# EAGLE design driver_inverter_potentio (EAGLE 9.0.1)
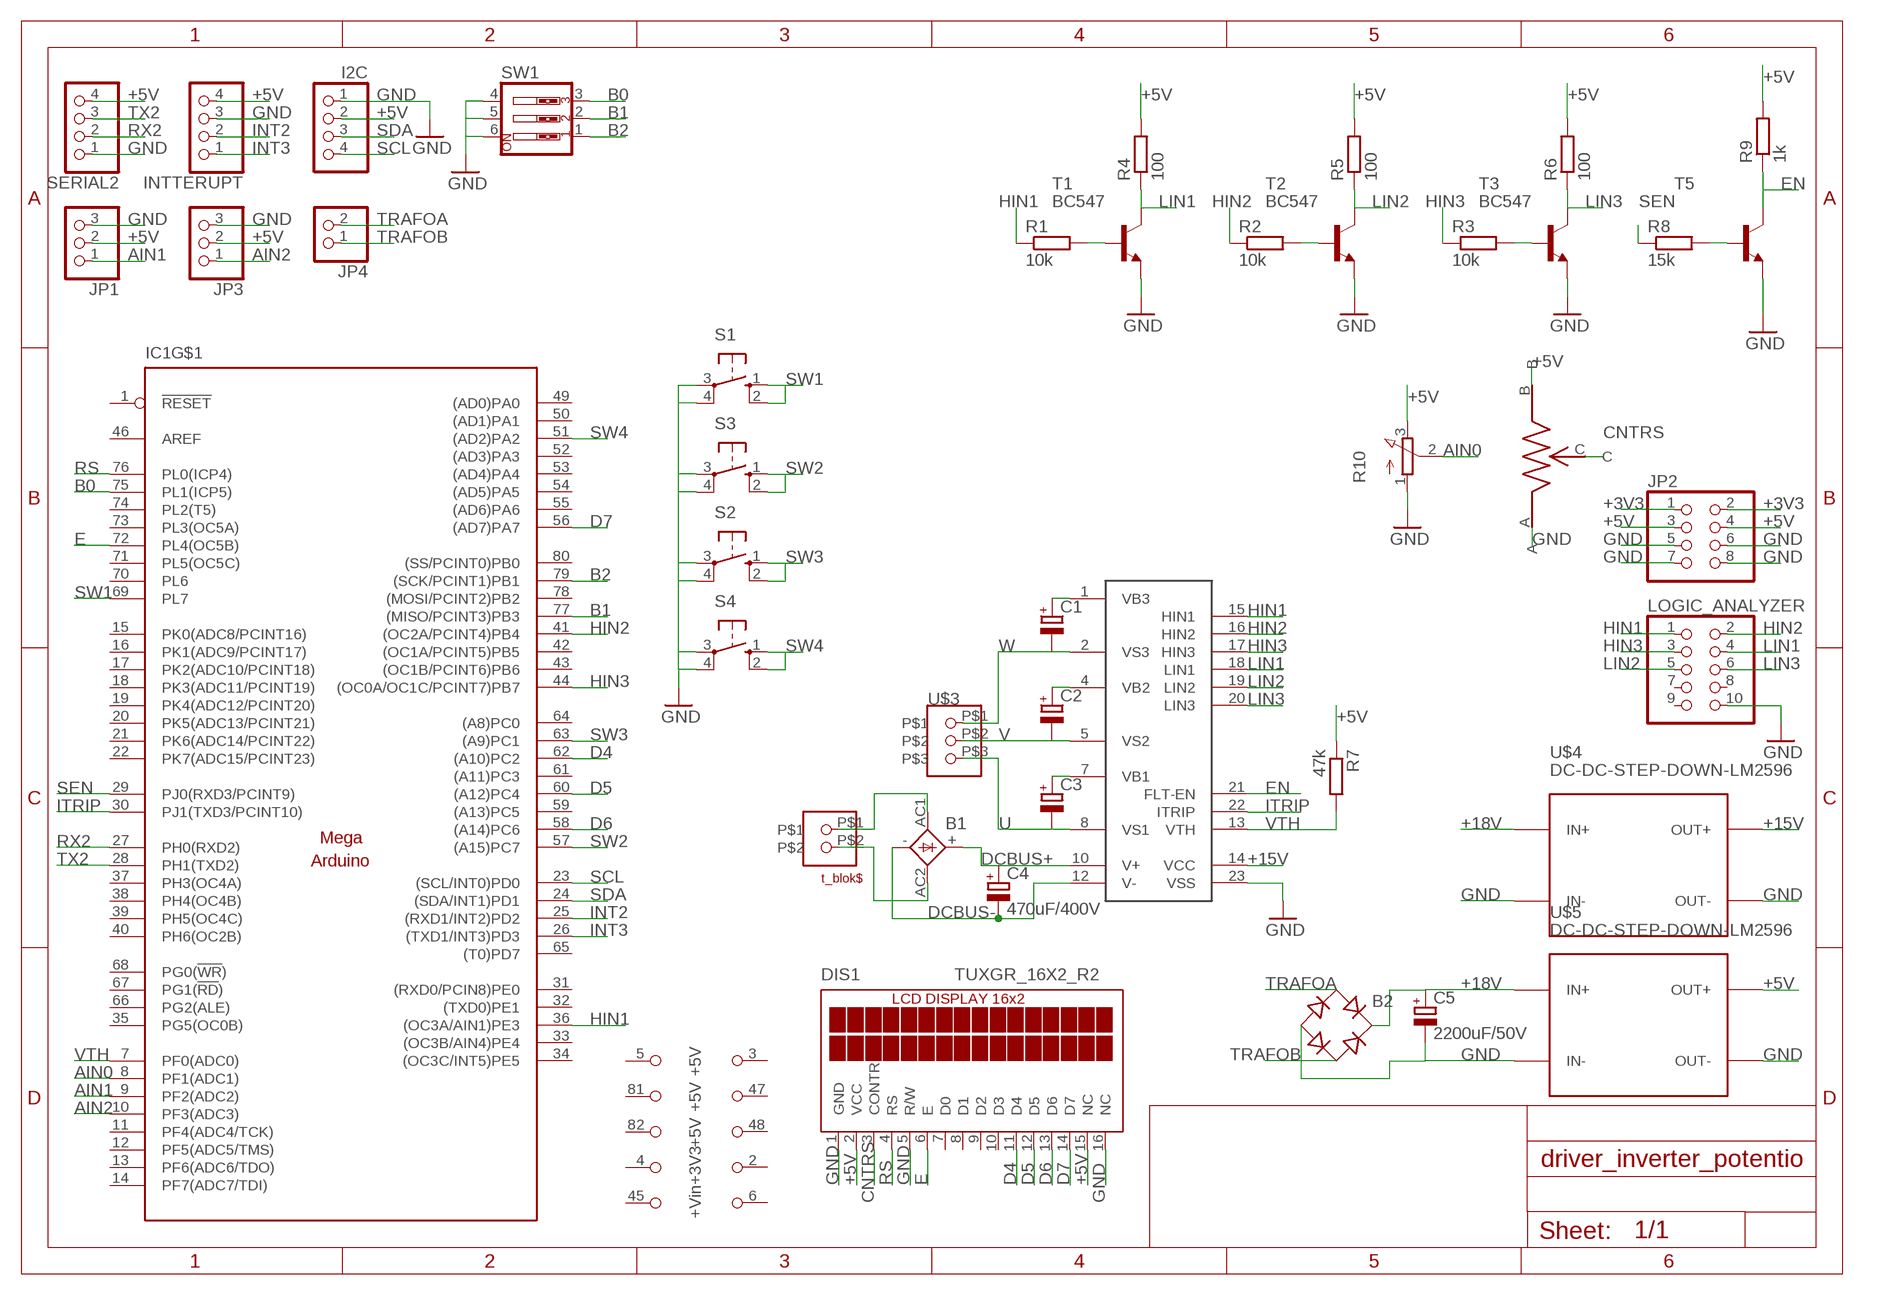
[diagram p0: schematic, sheet 1]

## Parts
B1  GBPC80X  [GBPC80X]
B2  RB1A  [RB1A]
C1  CPOL-EUE2.5-6  [E2,5-6]
C2  CPOL-EUE2.5-6  [E2,5-6]
C3  CPOL-EUE2.5-6  [E2,5-6]
C4  470uF/400V  CPOL-EUE10-25  [EB25D]
C5  2200uF/50V  CPOL-EUE7.5-16  [E7,5-16]
DIS1  TUXGR_16X2_R2  [TUXGR_16X2_R2]
I2C  PINHD-1X4  [1X04]
IC1  MEGAARDUINO_22  [MEGA_ARDUINO_2]
INTTERUPT  PINHD-1X4  [1X04]
JP1  PINHD-1X3  [1X03]
JP2  PINHD-2X4  [2X04]
JP3  PINHD-1X3  [1X03]
JP4  PINHD-1X2  [1X02]
LOGIC_ANALYZER  PINHD-2X5  [2X05]
R1  10k  R-EU_0207/10  [0207/10]
R2  10k  R-EU_0207/10  [0207/10]
R3  10k  R-EU_0207/10  [0207/10]
R4  100  R-EU_0207/10  [0207/10]
R5  100  R-EU_0207/10  [0207/10]
R6  100  R-EU_0207/10  [0207/10]
R7  47k  R-EU_0207/10  [0207/10]
R8  15k  R-EU_0207/10  [0207/10]
R9  1k  R-EU_0207/10  [0207/10]
R10  3RP/1610N  [3RP/1610N]
S1  10-XX  [B3F-10XX]
S2  10-XX  [B3F-10XX]
S3  10-XX  [B3F-10XX]
S4  10-XX  [B3F-10XX]
SERIAL2  PINHD-1X4  [1X04]
SW1  SW_DIP-3  [EDG-03]
T1  BC547  [TO92]
T2  BC547  [TO92]
T3  BC547  [TO92]
T5  BC317-NPN-TO92-EBC  [TO92-EBC]
U$1  IRAMS  [IRAMS]
U$2  TBLOCK_1X2  [TBLOCK_1X2]
U$3  TBLOCK_3PIN  [TBLOCK_1X3]
U$4  DC-DC-STEP-DOWN-LM2596  [DC-DC-STEP-DOWN-LM2596]
U$5  DC-DC-STEP-DOWN-LM2596  [DC-DC-STEP-DOWN-LM2596]
U$6  POTENSIO  [POTENSIO]

## Nets
+3V3: JP2.1 JP2.2
+5V: DIS1.2(VCC) DIS1.15(NC) I2C.2 INTTERUPT.4 JP1.2 JP2.3 JP2.4 JP3.2 R4.2 R5.2 R6.2 R7.1 R9.2 R10.3(E) SERIAL2.4 U$5.OUT+ U$6.B
+15V: U$1.14(VCC) U$4.OUT+
+18V: B2.+ C5.+ U$4.IN+ U$5.IN+
AIN0: IC1.8(PF1(ADC1)) R10.2(S)
AIN1: IC1.9(PF2(ADC2)) JP1.1
AIN2: IC1.10(PF3(ADC3)) JP3.1
B0: IC1.75(PL1(ICP5)) SW1.3
B1: IC1.77((MISO/PCINT3)PB3) SW1.2
B2: IC1.79((SCK/PCINT1)PB1) SW1.1
CNTRS: DIS1.3(CONTR) U$6.C
D4: DIS1.11(D4) IC1.62((A10)PC2)
D5: DIS1.12(D5) IC1.60((A12)PC4)
D6: DIS1.13(D6) IC1.58((A14)PC6)
D7: DIS1.14(D7) IC1.56((AD7)PA7)
DCBUS+: B1.+ C4.+ U$1.10(V+)
DCBUS-: B1.- C4.- U$1.12(V-)
E: DIS1.6(E) IC1.72(PL4(OC5B))
EN: R9.1 T5.C U$1.21(FLT-EN)
GND: B2.- C5.- DIS1.1(GND) DIS1.5(R/W) DIS1.16(NC) I2C.1 INTTERUPT.3 JP1.3 JP2.5 JP2.6 JP2.7 JP2.8 JP3.3 LOGIC_ANALYZER.10 R10.1(A) S1.3(P) S1.4(P1) S2.3(P) S2.4(P1) S3.3(P) S3.4(P1) S4.3(P) S4.4(P1) SERIAL2.1 SW1.4 SW1.5 SW1.6 T1.1(E) T2.1(E) T3.1(E) T5.E U$1.23(VSS) U$4.IN- U$4.OUT- U$5.IN- U$5.OUT- U$6.A
HIN1: IC1.36((OC3A/AIN1)PE3) LOGIC_ANALYZER.1 R1.1 U$1.15(HIN1)
HIN2: IC1.41((OC2A/PCINT4)PB4) LOGIC_ANALYZER.2 R2.1 U$1.16(HIN2)
HIN3: IC1.44((OC0A/OC1C/PCINT7)PB7) LOGIC_ANALYZER.3 R3.1 U$1.17(HIN3)
INT2: IC1.25((RXD1/INT2)PD2) INTTERUPT.2
INT3: IC1.26((TXD1/INT3)PD3) INTTERUPT.1
ITRIP: IC1.30(PJ1(TXD3/PCINT10)) U$1.22(ITRIP)
LIN1: LOGIC_ANALYZER.4 R4.1 T1.3(C) U$1.18(LIN1)
LIN2: LOGIC_ANALYZER.5 R5.1 T2.3(C) U$1.19(LIN2)
LIN3: LOGIC_ANALYZER.6 R6.1 T3.3(C) U$1.20(LIN3)
N$1: C1.+ U$1.1(VB3)
N$2: R1.2 T1.2(B)
N$4: C2.+ U$1.4(VB2)
N$5: R3.2 T3.2(B)
N$6: R2.2 T2.2(B)
N$8: C3.+ U$1.7(VB1)
N$10: B1.AC1 U$2.P$1
N$11: B1.AC2 U$2.P$2
N$12: R8.2 T5.B
RS: DIS1.4(RS) IC1.76(PL0(ICP4))
RX2: IC1.27(PH0(RXD2)) SERIAL2.2
SCL: I2C.4 IC1.23((SCL/INT0)PD0)
SDA: I2C.3 IC1.24((SDA/INT1)PD1)
SEN: IC1.29(PJ0(RXD3/PCINT9)) R8.1
SW1: IC1.69(PL7) S1.1(S) S1.2(S1)
SW2: IC1.57((A15)PC7) S3.1(S) S3.2(S1)
SW3: IC1.63((A9)PC1) S2.1(S) S2.2(S1)
SW4: IC1.51((AD2)PA2) S4.1(S) S4.2(S1)
TRAFOA: B2.AC1 JP4.2
TRAFOB: B2.AC2 JP4.1
TX2: IC1.28(PH1(TXD2)) SERIAL2.3
U: C3.- U$1.8(VS1) U$3.P$3
V: C2.- U$1.5(VS2) U$3.P$2
VTH: IC1.7(PF0(ADC0)) R7.2 U$1.13(VTH)
W: C1.- U$1.2(VS3) U$3.P$1
Unconnected: DIS1.7(D0) DIS1.8(D1) DIS1.9(D2) DIS1.10(D3) IC1.1(!RESET) IC1.11(PF4(ADC4/TCK)) IC1.12(PF5(ADC5/TMS)) IC1.13(PF6(ADC6/TDO)) IC1.14(PF7(ADC7/TDI)) IC1.15(PK0(ADC8/PCINT16)) IC1.16(PK1(ADC9/PCINT17)) IC1.17(PK2(ADC10/PCINT18)) IC1.18(PK3(ADC11/PCINT19)) IC1.19(PK4(ADC12/PCINT20)) IC1.20(PK5(ADC13/PCINT21)) IC1.21(PK6(ADC14/PCINT22)) IC1.22(PK7(ADC15/PCINT23)) IC1.31((RXD0/PCIN8)PE0) IC1.32((TXD0)PE1) IC1.33((OC3B/AIN4)PE4) IC1.34((OC3C/INT5)PE5) IC1.35(PG5(OC0B)) IC1.37(PH3(OC4A)) IC1.38(PH4(OC4B)) IC1.39(PH5(OC4C)) IC1.40(PH6(OC2B)) IC1.42((OC1A/PCINT5)PB5) IC1.43((OC1B/PCINT6)PB6) IC1.46(AREF) IC1.49((AD0)PA0) IC1.50((AD1)PA1) IC1.52((AD3)PA3) IC1.53((AD4)PA4) IC1.54((AD5)PA5) IC1.55((AD6)PA6) IC1.59((A13)PC5) IC1.61((A11)PC3) IC1.64((A8)PC0) IC1.65((T0)PD7) IC1.66(PG2(ALE)) IC1.67(PG1(!RD!)) IC1.68(PG0(!WR!)) IC1.70(PL6) IC1.71(PL5(OC5C)) IC1.73(PL3(OC5A)) IC1.74(PL2(T5)) IC1.78((MOSI/PCINT2)PB2) IC1.80((SS/PCINT0)PB0) LOGIC_ANALYZER.7 LOGIC_ANALYZER.8 LOGIC_ANALYZER.9

## Power pins joined to a net without a drawn wire
+3V3: IC1.2(+3V3)
+5V: IC1.3(+5V) IC1.47(+5V) IC1.48(+5V)
+VIN: IC1.6(+VIN)
GND: IC1.4(GND) IC1.5(GND) IC1.45(GND) IC1.81(GND) IC1.82(GND)

## Library data of the parts
B1 = rectifier:GBPC80X: GENERAL INSTRUMENT RECTIFIER
B2 = rectifier:RB1A: RECTIFIER 1 A
C1-C5 = rcl:CPOL-EU: POLARIZED CAPACITOR, European symbol; SPICEPREFIX: C
DIS1 = display-lcd:TUXGR_16X2_R2: Tuxgraphics LCD display 16x2 characters reflective, without background light Source: tuxgr_12x2_r2.pdf; OC_FARNELL: unknown; OC_NEWARK: unknown
I2C INTTERUPT SERIAL2 = pinhead:PINHD-1X4: PIN HEADER
IC1 = arduino_2:MEGAARDUINO_2: The Arduino Mega is a microcontroller board based on the ATmega1280. - 54 digital input/output pins (of which 14 can be used as PWM outputs) - 16 analog inputs - 4 UARTs (hardware serial ports) - 16 MHz crystal oscillator - USB connection - power jack - ICSP header - reset button It contains everything needed to support the microcontroller; simply connect it to a computer with a USB cable or power it with a AC-to-DC adapter or battery to get started. The Mega is compatible with most shields designed for the Arduino Duemilanove or Diecimila. http://arduino.cc/en/Main/ArduinoBoardMega
JP1 JP3 = pinhead:PINHD-1X3: PIN HEADER
JP2 = pinhead:PINHD-2X4: PIN HEADER
JP4 = pinhead:PINHD-1X2: PIN HEADER
LOGIC_ANALYZER = pinhead:PINHD-2X5: PIN HEADER
R1-R9 = rcl:R-EU_: RESISTOR, European symbol; SPICEPREFIX: R
R10 = pot:3RP/1610N: 16mm Potentiometer one level Source: http://www.alphapotentiometers.net/html/16mm_pot_2.html
S1-S4 = switch-omron:10-XX: OMRON SWITCH; MPN: B3F-1000; OC_FARNELL: 176432; OC_NEWARK: 36M3542
SW1 = special:SW_DIP-3: DIP SWITCH
T1-T3 = transistor:BC547: NPN TRANSISTOR
T5 = transistor:*-NPN-: NPN Transistror BF959 corrected 2008.03.06
U$1 = irams_custom:IRAMS
U$2 = custom:TBLOCK_1X2
U$3 = custom:TBLOCK_3PIN
U$4 U$5 = diy-modules:DC-DC-STEP-DOWN-LM2596: DC/DC Step-Down Regulator based on LM2596-ADJ chip LM2596 datasheet available here: http://www.ti.com/lit/ds/symlink/lm2596.pdf Click here to find device on ebay.com <http://www.ebay.com/sch/lm2596+power+regulator>
U$6 = custom:POTENSIO

## Board
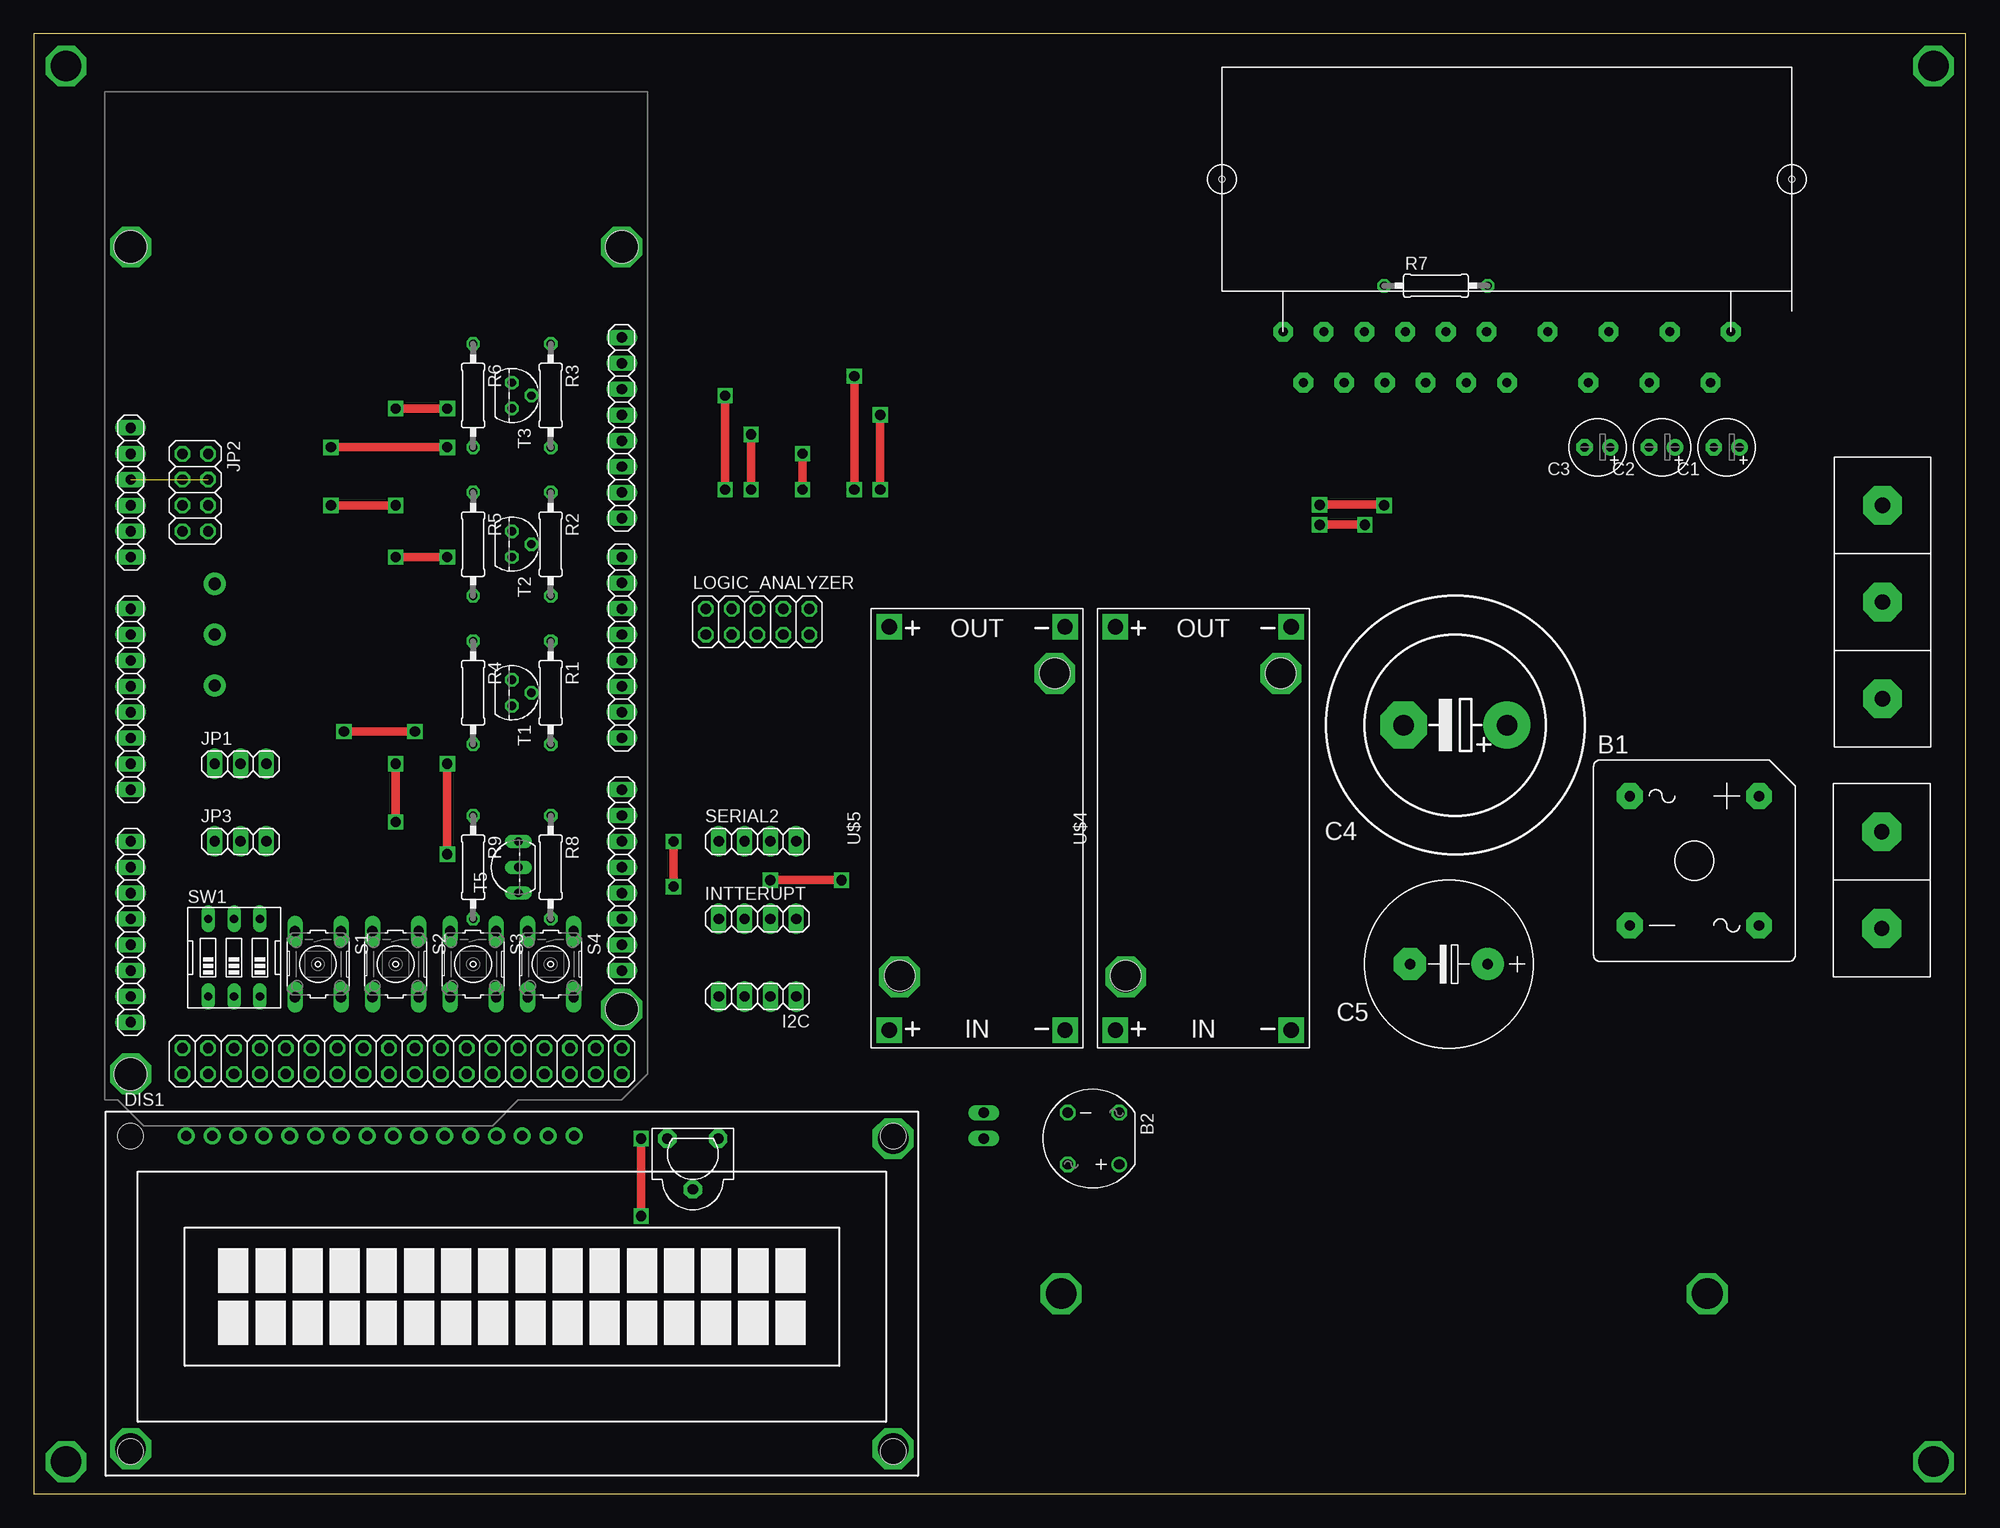
[diagram p1: board, top side]
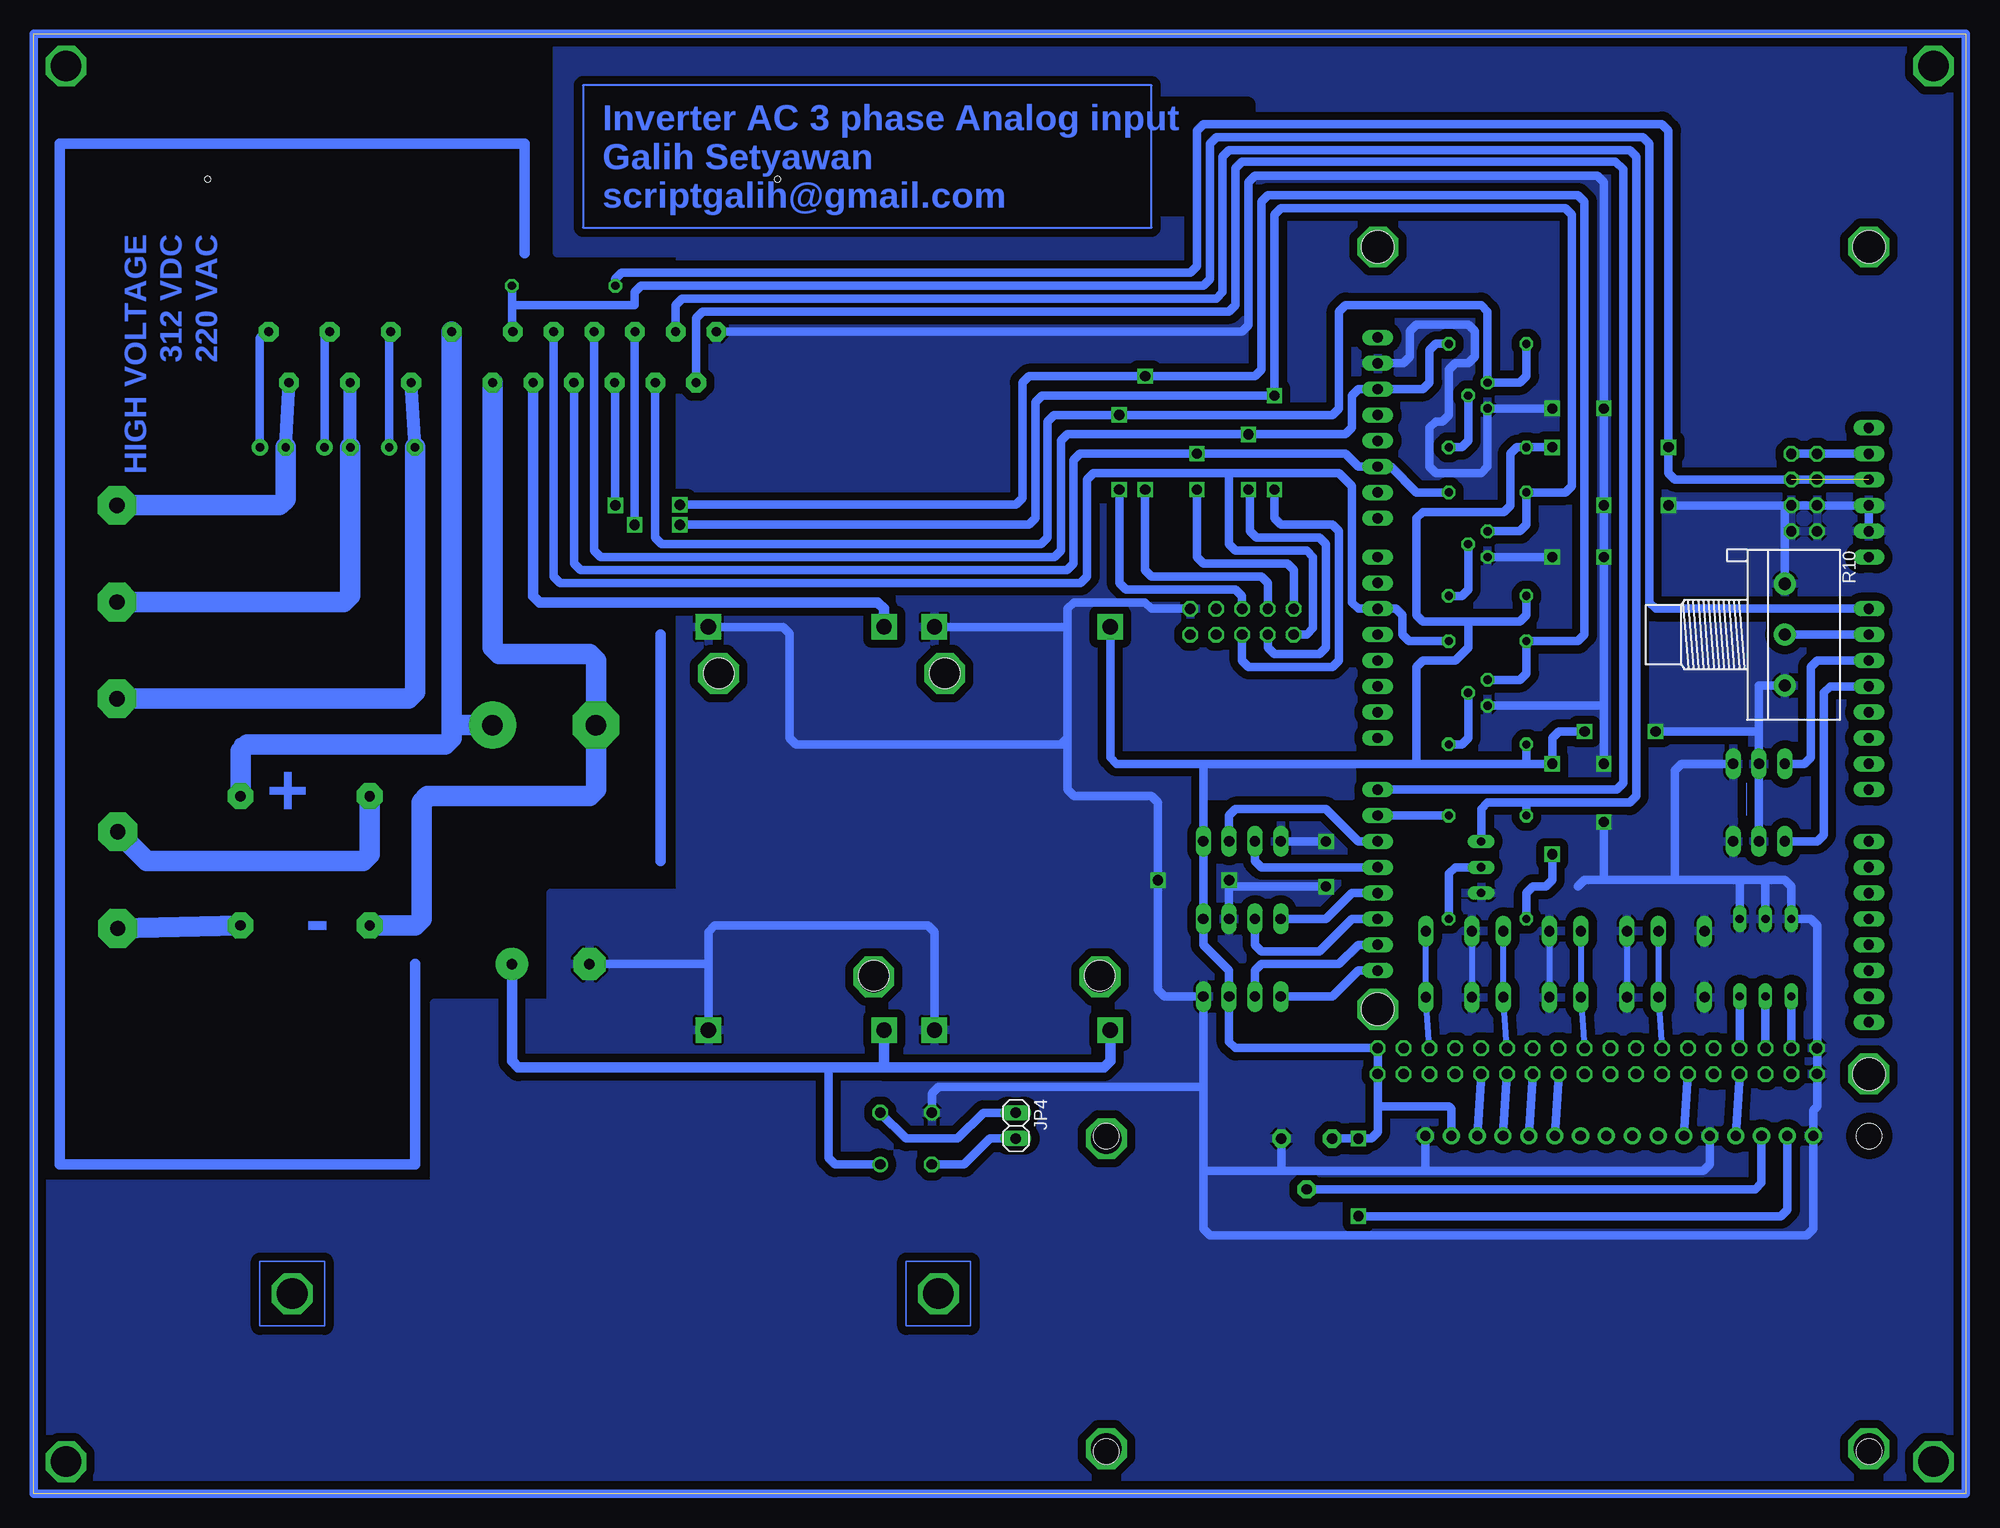
[diagram p2: board, bottom side, seen from below]

Size 189.87 x 143.51 mm. Coordinates in mm from the lower left corner, seen from the top.
Outline: 189.87,0 189.87,143.51 0,143.51 0,0 189.87,0
Copper layers (1*16): Top 0.035mm / dielectric 1.5mm / Bottom 0.035mm
Design rules "default": minimum track width 6mil, minimum drill 0.35mm, track to track 6mil, track to pad 6mil, pad to pad 6mil, via to via 6mil, smd to smd 6mil, copper to edge 40mil, drill to drill 6mil, minimum pad ring 10mil, minimum via ring 8mil, stop-mask expansion 4mil, vias tented up to drill 0mil, thermal gap 10mil

### Footprints (pad centres in the part's own frame; a part is rotated, then mirrored left to right if it is on the bottom)
GBPC80X = drill 1.016 pad 2.54 octagon: + 6.35,6.35; - -6.35,-6.35; AC1 -6.35,6.35; AC2 6.35,-6.35
RB1A = drill 1.016: + -2.54,2.54 | drill 1.016 octagon: - 2.54,-2.54; AC1 2.54,2.54; AC2 -2.54,-2.54
E2,5-6 = drill 0.813 pad 1.6: + -1.27,0 | drill 0.813 pad 1.6 octagon: - 1.27,0
EB25D = drill 2.007 pad 4.597: + -5.08,0 | drill 2.007 pad 4.597 octagon: - 5.08,0
E7,5-16 = drill 1.016 pad 3.15: + -3.81,0 | drill 1.016 pad 3.15 octagon: - 3.81,0
TUXGR_16X2_R2 = drill 1 pad 1.676: 1 -32,15.5; 2 -29.46,15.5; 3 -26.92,15.5; 4 -24.38,15.5; 5 -21.84,15.5; 6 -19.3,15.5; 7 -16.76,15.5; 8 -14.22,15.5; 9 -11.68,15.5; 10 -9.14,15.5; 11 -6.6,15.5; 12 -4.06,15.5; 13 -1.52,15.5; 14 1.02,15.5; 15 3.56,15.5; 16 6.1,15.5 | hole 2.5: -37.5,-15.5; 37.5,-15.5; -37.5,15.5; 37.5,15.5
1X04 = drill 1.016 long: 1 -3.81,0; 2 -1.27,0; 3 1.27,0; 4 3.81,0
MEGA_ARDUINO_2 = drill 1.016 long: 1 33.02,2.54; 2 35.56,2.54; 3 38.1,2.54; 4 40.64,2.54; 5 43.18,2.54; 6 45.72,2.54; 7 50.8,2.54; 8 53.34,2.54; 9 55.88,2.54; 10 58.42,2.54; 11 60.96,2.54; 12 63.5,2.54; 13 66.04,2.54; 14 68.58,2.54; 15 73.66,2.54; 16 76.2,2.54; 17 78.74,2.54; 18 81.28,2.54; 19 83.82,2.54; 20 86.36,2.54; 21 88.9,2.54; 22 91.44,2.54; 23 86.36,50.8; 24 83.82,50.8; 25 81.28,50.8; 26 78.74,50.8; 27 76.2,50.8; 28 73.66,50.8; 29 71.12,50.8; 30 68.58,50.8; 31 63.5,50.8; 32 60.96,50.8; 33 58.42,50.8; 34 55.88,50.8; 35 53.34,50.8; 36 50.8,50.8; 37 48.26,50.8; 38 45.72,50.8; 39 41.91,50.8; 40 39.37,50.8; 41 36.83,50.8; 42 34.29,50.8; 43 31.75,50.8; 44 29.21,50.8; 45 26.67,50.8; 46 24.13,50.8 | drill 1.016 octagon: 47 93.98,50.8; 48 96.52,50.8; 49 93.98,48.26; 50 96.52,48.26; 51 93.98,45.72; 52 96.52,45.72; 53 93.98,43.18; 54 96.52,43.18; 55 93.98,40.64; 56 96.52,40.64; 57 93.98,38.1; 58 96.52,38.1; 59 93.98,35.56; 60 96.52,35.56; 61 93.98,33.02; 62 96.52,33.02; 63 93.98,30.48; 64 96.52,30.48; 65 93.98,27.94; 66 96.52,27.94; 67 93.98,25.4; 68 96.52,25.4; 69 93.98,22.86; 70 96.52,22.86; 71 93.98,20.32; 72 96.52,20.32; 73 93.98,17.78; 74 96.52,17.78; 75 93.98,15.24; 76 96.52,15.24; 77 93.98,12.7; 78 96.52,12.7; 79 93.98,10.16; 80 96.52,10.16; 81 93.98,7.62; 82 96.52,7.62 | hole 3.2: 15.24,50.8; 15.24,2.54; 90.17,50.8; 96.52,2.54
1X03 = drill 1.016 long: 1 -2.54,0; 2 0,0; 3 2.54,0
2X04 = drill 1.016 octagon: 1 -3.81,-1.27; 2 -3.81,1.27; 3 -1.27,-1.27; 4 -1.27,1.27; 5 1.27,-1.27; 6 1.27,1.27; 7 3.81,-1.27; 8 3.81,1.27
1X02 = drill 1.016 long: 1 -1.27,0; 2 1.27,0
2X05 = drill 1.016 octagon: 1 -5.08,-1.27; 2 -5.08,1.27; 3 -2.54,-1.27; 4 -2.54,1.27; 5 0,-1.27; 6 0,1.27; 7 2.54,-1.27; 8 2.54,1.27; 9 5.08,-1.27; 10 5.08,1.27
0207/10 = drill 0.813 octagon: 1 -5.08,0; 2 5.08,0
3RP/1610N = drill 1.2 pad 2.184: 1 -5,0; 2 0,0; 3 5,0
B3F-10XX = drill 1.016 long: 1 -3.251,2.261; 2 3.251,2.261; 3 -3.251,-2.261; 4 3.251,-2.261
EDG-03 = drill 0.813 long: 1 -2.54,-3.81; 2 0,-3.81; 3 2.54,-3.81; 4 2.54,3.81; 5 0,3.81; 6 -2.54,3.81
TO92 = drill 0.813 octagon: 1 1.27,0; 2 0,1.905; 3 -1.27,0
TO92-EBC = drill 0.813 long: B 0,-1.27; C 2.54,-1.27; E -2.54,-1.27
IRAMS = drill 0.9 pad 1.93 octagon: 1 -22,-5; 2 -20,0; 4 -16,-5; 5 -14,0; 7 -10,-5; 8 -8,0; 10 -4,-5; 12 0,0; 13 2,-5; 14 4,0; 15 6,-5; 16 8,0; 17 10,-5; 18 12,0; 19 14,-5; 20 16,0; 21 18,-5; 22 20,0; 23 22,-5 | hole 0.6: -28,-20; 28,-20
TBLOCK_1X2 = drill 1.5 pad 3.81 octagon: P$1 0,4.75; P$2 0,-4.75
TBLOCK_1X3 = drill 1.5 pad 3.81 octagon: P$1 0.07,9.53; P$2 0.07,0.03; P$3 0.07,-9.47
DC-DC-STEP-DOWN-LM2596 = drill 1.5 pad 2.5 square: IN+ -19.812,8.636; IN- -19.812,-8.636; OUT+ 19.812,8.636; OUT- 19.812,-8.636 | hole 3: -14.478,7.62; 15.24,-7.62
POTENSIO = drill 1 pad 1.778 octagon: A -2.5,0; B 2.5,0; C 0,5

### Placement (x,y rotation side)
B1  163.19,62.23 0 top
B2  104.14,34.92 180 top
C1  166.37,102.87 180 top
C2  160.02,102.87 180 top
C3  153.67,102.87 180 top
C4  139.7,75.56 180 top
C5  139.06,52.07 180 top
DIS1  46.99,19.68 0 top
I2C  71.12,48.89 180 top
IC1  6.98,137.8 270 top
INTTERUPT  71.12,56.52 0 top
JP1  20.32,71.75 0 top
JP2  15.88,98.42 270 top
JP3  20.32,64.13 0 top
JP4  93.34,36.19 270 bottom
LOGIC_ANALYZER  71.12,85.72 0 top
R1  50.8,78.74 270 top
R2  50.8,93.34 270 top
R3  50.8,107.95 270 top
R4  43.18,78.74 270 top
R5  43.18,93.34 270 top
R6  43.18,107.95 270 top
R7  137.8,118.75 0 top
R8  50.8,61.59 270 top
R9  43.18,61.59 270 top
R10  17.78,84.45 270 bottom
S1  27.94,52.07 270 top
S2  35.56,52.07 270 top
S3  43.18,52.07 270 top
S4  50.8,52.07 270 top
SERIAL2  71.12,64.13 0 top
SW1  19.69,52.7 0 top
T1  46.99,78.74 270 top
T2  46.99,93.34 270 top
T3  46.99,107.95 270 top
T5  46.36,61.59 90 top
U$1  144.78,109.22 180 top
U$2  181.61,60.32 0 top
U$3  181.61,87.63 0 top
U$4  114.94,65.41 90 top
U$5  92.71,65.41 90 top
U$6  64.77,34.92 180 top

### Tracks (layer width: path | path; a pad name or v marks a point on that pad's centre or on a via)
+3V3
  Bottom 0.813: IC1.2 JP2.1 JP2.2
+5V  (via drill 1 pad 1.5)  (2 unrouted)
  Top 0.813: v40.64,62.86 v40.64,71.75 | v40.64,102.87 v29.21,102.87 | v37.47,74.93 v30.48,74.93 | v59.69,34.92 v59.69,27.3
  Bottom 0.813: R5.2 43.18,86.36 43.81,85.72 48.89,85.72 | 48.89,85.72 48.89,83.19 50.16,81.91 53.34,81.91 53.98,81.28 53.98,71.75 | 48.89,85.72 53.34,85.72 53.98,86.36 53.98,95.88 53.34,96.52 45.4,96.52 44.77,97.16 44.77,102.23 44.13,102.87 R6.2 v40.64,102.87 | IC1.3 28.57,99.69 29.21,100.33 v29.21,102.87 29.21,133.99 29.84,134.62 74.93,134.62 75.56,133.99 75.56,120.65 76.2,120.02 132.08,120.02 132.72,119.38 R7.1 | 74.93,71.75 SERIAL2.4 INTTERUPT.4 74.93,53.98 72.39,51.43 I2C.2 72.39,44.45 71.75,43.81 IC1.47 IC1.48 | 62.23,34.97 U$6.B v59.69,34.92 58.42,34.92 57.78,35.56 57.78,38.1 | DIS1.15 50.55,37.85 50.8,38.1 57.78,38.1 | 57.78,38.73 IC1.48 | 57.78,38.1 IC1.48 | R10.3 20.32,79.45 20.32,74.93 | 20.32,74.93 JP1.2 JP3.2 | DIS1.2 17.53,31.11 | 17.53,31.11 17.53,27.94 18.16,27.3 v59.69,27.3 | 53.98,71.75 74.93,71.75 | 43.18,71.75 53.98,71.75 | R4.2 43.18,71.75 | 43.18,71.75 v40.64,71.75 40.64,74.3 40.01,74.93 v37.47,74.93 | 74.93,71.75 83.44,71.75 84.07,72.39 U$5.OUT+ | v30.48,74.93 20.32,74.93 | R9.2 43.18,59.05 42.55,59.69 41.27,59.69 40.64,60.32 v40.64,62.86 | 17.53,31.11
  pour Bottom (isolate 0.813): 20.32,64.13 15.24,64.13 15.24,85.72 31.12,85.72 31.12,74.93 20.95,74.93 20.95,64.13
  pour Bottom (isolate 0.813): 60.33,71.75 60.33,68.58 74.3,68.58 74.93,68.58 74.93,71.75
+15V
  Bottom 1.016: U$4.OUT+ 106.3,87 106.93,87.63 140.15,87.63 140.78,88.27 U$1.14
+18V
  Bottom 0.813: B2.+ 111.12,32.38 111.76,33.02 111.76,41.91
  Bottom 1.016: 106.3,41.91 84.71,41.91 84.07,42.55 U$5.IN+ | U$4.IN+ 106.3,41.91 | C5.+ 142.88,42.55 142.24,41.91 111.76,41.91 106.3,41.91
AIN0
  Bottom 0.813: R10.2 IC1.8
AIN1
  Bottom 0.813: JP1.1 15.88,71.75 15.24,72.39 15.24,81.28 14.61,81.91 IC1.9
AIN2
  Bottom 0.813: JP3.1 14.61,64.13 13.97,64.77 13.97,78.74 13.34,79.38 IC1.10
B0
  Bottom 0.813: IC1.75 SW1.3
B1
  Bottom 0.813: IC1.77 SW1.2
B2
  Bottom 0.813: IC1.79 SW1.1
CNTRS
  Bottom 0.813: U$6.C 20.7,29.92 20.07,30.56 DIS1.3
D4
  Bottom 0.813: DIS1.11 IC1.62
D5
  Bottom 0.813: DIS1.12 IC1.60
D6
  Bottom 0.813: DIS1.13 IC1.58
D7
  Bottom 0.813: IC1.56 DIS1.14
DCBUS+
  Bottom 1.27: U$1.10 148.59,114.03 | B1.+ 169.54,73.66
  Bottom 2: 148.78,75.56 148.78,74.3 149.41,73.66 168.91,73.66 169.54,73.03 B1.+ | 148.78,75.56 U$1.10 | C4.+ 148.78,75.56
DCBUS-
  Bottom 1.27: C4.- 134.62,69.85
  Bottom 2: B1.- 152.4,55.88 151.77,56.52 151.77,67.94 151.13,68.58 135.25,68.58 134.62,69.22 C4.- 134.62,81.91 135.25,82.55 144.15,82.55 144.78,83.19 U$1.12
E
  Bottom 0.813: DIS1.6 IC1.72
EN
  Bottom 0.813: T5.C 47.62,67.31 46.99,67.94 43.18,67.94 | 43.18,67.94 33.02,67.94 32.38,68.58 32.38,131.44 33.02,132.08 72.39,132.08 73.03,131.44 73.03,118.11 73.66,117.47 126.14,117.47 126.78,116.84 U$1.21 | R9.1 43.18,67.94
GND  (via drill 1 pad 1.5)
  Top 0.813: v40.64,106.68 v35.56,106.68 | v40.64,92.07 v35.56,92.07 | v35.56,97.16 v29.21,97.16 | v62.86,59.69 v62.86,64.13 | v79.38,60.32 v72.39,60.32 | v35.56,71.75 v35.56,66.04
  Bottom 0.61: S2.3 S2.4 | S3.3 S3.4 | S4.3 S4.4
  Bottom 0.813: v40.64,106.68 T3.1 46.99,100.97 47.62,100.33 52.07,100.33 52.7,100.97 52.7,104.78 52.07,105.41 51.44,105.41 50.8,106.05 50.8,110.49 50.16,111.12 48.89,111.12 48.26,111.76 48.26,114.3 48.89,114.94 53.98,114.94 54.61,114.3 54.61,111.76 55.25,111.12 IC1.45 | T2.1 v40.64,92.07 | v35.56,71.75 35.56,77.47 | 35.56,77.47 v35.56,92.07 v35.56,97.16 v35.56,106.68 35.56,128.91 36.2,129.54 69.85,129.54 70.48,128.91 70.48,114.85 71.12,114.22 U$1.23 | v29.21,97.16 17.78,97.16 | 17.78,97.16 IC1.4 IC1.5 | 72.39,58.42 INTTERUPT.3 v72.39,60.32 | v62.86,64.13 SERIAL2.1 | 72.39,59.69 v62.86,59.69 | 88.9,73.66 114.94,73.66 115.57,74.3 115.57,84.58 116.2,85.22 U$4.OUT- | 88.27,85.09 88.27,87 87.63,87.63 80.64,87.63 80.01,87 LOGIC_ANALYZER.10 | 88.27,85.09 88.27,74.3 | 88.9,73.66 88.27,74.3 | U$5.IN- 101.35,55.24 101.98,55.88 122.94,55.88 123.57,55.24 123.57,52.07 | 88.27,85.09 88.39,85.22 U$5.OUT- | 74.93,31.75 74.93,26.03 74.3,25.4 15.62,25.4 14.99,26.03 DIS1.1 14.99,37.71 14.61,38.1 IC1.82 IC1.81 14.61,55.88 15.24,56.52 SW1.6 17.14,59.69 17.78,60.32 19.69,60.32 | 74.93,31.75 74.93,40 | 74.93,40 I2C.1 78.74,48.89 79.38,49.53 v79.38,60.32 79.38,67.94 80.01,68.58 87.63,68.58 88.27,69.22 88.27,73.66 | DIS1.5 25.15,32.38 25.79,31.75 53.09,31.75 | 74.93,31.75 67.31,31.75 | 67.31,31.75 53.09,31.75 | 53.09,31.75 DIS1.16 | U$6.A 67.27,31.79 67.31,31.75 | R10.1 17.78,97.16 | 35.56,60.32 28.57,60.32 | JP1.3 27.94,71.75 28.57,71.12 28.57,60.32 | 28.57,60.32 22.23,60.32 | 22.23,60.32 19.69,60.32 | SW1.5 19.69,60.32 | SW1.4 22.23,60.32 | U$4.IN- 123.57,52.07 | C5.- 123.57,52.07 | 88.27,73.66 88.27,74.3 | 88.9,73.66 88.27,73.66
  Bottom 0.813: v35.56,66.04 35.56,60.32 | 38.1,59.69 37.47,60.32 35.56,60.32 | T1.1 35.56,77.47 | B2.- 101.6,39.37 100.97,40 74.93,40
  pour Bottom (isolate 0.813): 0,0 189.87,0 189.87,30.48 150.5,30.48 150.5,48.26 139.06,48.26 139.06,59.05 126.36,59.05 126.36,121.92 138.43,121.92 138.43,143.51 0,143.51
HIN1
  Bottom 0.813: U$1.15 138.78,90.17 138.15,89.53 87,89.53 86.36,90.17 86.36,99.69 85.72,100.33 72.39,100.33 | R1.1 54.74,83.82 55.37,84.45 55.37,86.36 56.01,87 IC1.36 59.69,87 60.33,87.63 60.33,99.06 61.59,100.33 72.39,100.33 | LOGIC_ANALYZER.1 64.77,84.45 64.14,85.09 64.14,92.07 64.77,92.71 71.75,92.71 72.39,93.34 72.39,100.33
HIN2  (via drill 1 pad 1.5)
  Top 0.813: v75.56,98.71 v75.56,102.23
  Bottom 0.813: R2.1 53.98,98.42 56.52,100.97 IC1.41 59.69,100.97 60.96,102.23 v75.56,102.23 87.06,102.23 87.7,101.6 87.7,91.44 88.33,90.81 136.15,90.81 136.78,91.44 U$1.16 | LOGIC_ANALYZER.2 66.04,90.81 66.67,91.44 74.93,91.44 75.56,92.07 v75.56,98.71
HIN3  (via drill 1 pad 1.5)
  Top 0.813: v70.48,98.71 v70.48,104.14
  Bottom 0.813: LOGIC_ANALYZER.3 68.58,83.19 67.94,82.55 63.5,82.55 62.86,83.19 62.86,93.34 63.5,93.98 69.71,93.98 70.35,94.61 70.35,98.27 v70.48,98.71 | R3.1 52.07,113.03 52.7,112.39 52.7,109.22 53.34,108.59 IC1.44 59.69,108.59 60.33,107.95 60.33,104.78 60.96,104.14 v70.48,104.14 88.27,104.14 88.91,103.5 88.91,92.71 89.54,92.07 134.15,92.07 134.78,92.71 U$1.17
INT2
  Bottom 0.813: INTTERUPT.2 69.85,53.98 69.22,53.34 63.5,53.34 60.33,56.52 IC1.25
INT3
  Bottom 0.813: INTTERUPT.1 62.86,56.52 60.33,59.05 IC1.26
ITRIP
  Bottom 0.813: IC1.30 34.29,69.22 33.66,69.85 33.66,130.18 34.42,130.94 71.12,130.94 71.75,130.31 71.75,116.84 72.39,116.2 124.14,116.2 124.78,115.57 U$1.22
LIN1  (via drill 1 pad 1.5)
  Top 0.813: v126.36,97.21 132.66,97.21 v132.72,97.16 | v80.64,98.71 v80.64,109.85
  Bottom 0.813: T1.3 43.81,80.01 43.18,80.64 R4.1 38.1,83.82 37.47,84.45 37.47,127 38.1,127.64 68.58,127.64 69.22,127 69.22,110.49 69.85,109.85 v80.64,109.85 92.08,109.85 92.72,109.22 92.72,97.85 93.35,97.21 v126.36,97.21 | v132.72,97.16 132.72,109.16 U$1.18 | LOGIC_ANALYZER.4 68.58,89.53 69.22,90.17 80.01,90.17 80.64,90.81 v80.64,98.71
LIN2  (via drill 1 pad 1.5)
  Top 0.813: v67.94,98.71 v67.94,107.95 | v126.36,95.25 v130.81,95.25
  Bottom 0.813: T2.3 43.81,94.61 43.18,95.25 R5.1 39.37,98.42 38.73,99.06 38.73,125.73 39.37,126.36 67.31,126.36 67.94,125.73 v67.94,107.95 90.77,107.95 91.4,107.31 91.4,95.88 92.04,95.25 v126.36,95.25 | v130.81,95.25 130.81,114.19 U$1.19 | LOGIC_ANALYZER.5 71.12,81.91 70.48,81.28 62.23,81.28 61.59,81.91 61.59,94.61 62.23,95.25 67.31,95.25 67.94,95.88 v67.94,98.71
LIN3  (via drill 1 pad 1.5)
  Top 0.813: v83.19,98.71 v83.19,106.05
  Bottom 0.813: R6.1 43.18,109.85 43.81,109.22 T3.3 46.99,116.2 47.62,116.84 60.96,116.84 61.59,116.2 61.59,106.68 62.23,106.05 v83.19,106.05 89.59,106.05 90.22,105.41 90.22,93.98 90.86,93.34 128.15,93.34 128.78,93.98 U$1.20 | LOGIC_ANALYZER.6 71.12,88.27 71.75,88.9 82.55,88.9 83.19,89.53 v83.19,98.71
N$1
  Bottom 0.813: C1.+ 167.64,113.59 167,114.22 U$1.1
N$2
  Bottom 0.813: R1.2 49.53,73.66 48.89,74.3 T1.2
N$3  (via drill 3 pad 3.5)
  other vias: 3.18,3.17
N$4
  Bottom 0.813: C2.+ 161.29,113.71 U$1.4
N$5
  Bottom 0.813: R3.2 49.53,102.87 48.89,103.5 T3.2
N$6
  Bottom 0.813: R2.2 49.53,88.27 48.89,88.9 T2.2
N$7  (via drill 3 pad 3.5)
  other vias: 186.69,3.17
N$8
  Bottom 0.813: C3.+ 154.94,114.06 U$1.7
N$9  (via drill 3 pad 3.5)
  other vias: 186.69,140.33
N$10
  Bottom 2: B1.AC1 156.84,62.86 157.48,62.23 178.76,62.23 U$2.P$1
N$11
  Bottom 2: U$2.P$2 B1.AC2
N$12
  Bottom 0.813: R8.2 50.8,60.96 50.16,61.59 T5.B
N$13  (via drill 3 pad 3.5)
  other vias: 3.18,140.33
N$14
  Bottom 0.203: 135.89,138.43 135.89,124.46 80.01,124.46 80.01,138.43 135.89,138.43
N$15
  Bottom 1.016: 128.27,84.45 128.27,62.23
N$16
  Bottom 1.016: 152.4,52.07 152.4,32.38 187.32,32.38 187.32,132.72 141.6,132.72 141.6,121.92
N$17  (via drill 3 pad 3.5)
  other vias: 9.52,41.27
N$18  (via drill 3 pad 3.5)
  other vias: 57.78,47.62
N$19  (via drill 3 pad 3.5)
  other vias: 84.45,34.92
N$20  (via drill 3 pad 3.5)
  other vias: 85.09,50.8
N$21  (via drill 3 pad 3.5)
  other vias: 107.31,50.8
N$22  (via drill 3 pad 3.5)
  other vias: 122.55,80.64
N$23  (via drill 3 pad 3.5)
  other vias: 100.33,80.64
N$24  (via drill 3 pad 3.5)
  other vias: 57.78,122.55
N$25  (via drill 3 pad 3.5)
  other vias: 9.52,122.55
N$26  (via drill 3 pad 3.5)
  other vias: 84.45,4.45
N$27  (via drill 3 pad 3.5)
  other vias: 9.52,4.45
N$28
  Bottom 0.813: 0,0 189.87,0 189.87,143.51 0,143.51 0,0
N$29
  Bottom 0.076: 21.59,69.85 21.59,66.67
N$30  (via drill 3 pad 3.5)
  other vias: 100.97,19.68
N$31  (via drill 3 pad 3.5)
  other vias: 164.47,19.68
N$32
  Bottom 0.152: 100.33,22.86 99.69,22.86 97.79,22.86 97.79,16.51 104.14,16.51 104.14,22.86 100.33,22.86
N$33
  Bottom 0.152: 163.83,22.86 162.56,22.86 161.29,22.86 161.29,16.51 167.64,16.51 167.64,22.86 163.83,22.86
RS
  Bottom 0.813: DIS1.4 IC1.76
RX2
  Bottom 0.813: IC1.27 69.22,61.59 69.85,62.23 SERIAL2.2
SCL
  Bottom 0.813: IC1.23 59.69,51.43 62.23,48.89 I2C.4
SDA
  Bottom 0.813: IC1.24 59.69,53.98 61.59,52.07 69.22,52.07 69.85,51.43 I2C.3
SEN
  Bottom 0.813: R8.1 IC1.29
SW1
  Bottom 0.61: S1.1 S1.2 IC1.69
SW2
  Bottom 0.61: S3.1 S3.2 IC1.57
SW3
  Bottom 0.61: S2.1 S2.2 IC1.63
SW4
  Bottom 0.61: IC1.51 S4.2 S4.1
TRAFOA
  Bottom 0.813: JP4.2 95.88,34.92 98.42,32.38 B2.AC1
TRAFOB
  Bottom 0.813: JP4.1 96.52,37.46 99.06,34.92 104.14,34.92 B2.AC2
TX2
  Bottom 0.813: SERIAL2.3 72.39,66.67 71.75,67.31 62.86,67.31 59.69,64.13 IC1.28
U
  Bottom 1.27: C3.- U$1.8
  Bottom 2: U$3.P$3 153.03,78.16 152.4,78.8 C3.-
V
  Bottom 1.27: C2.- U$1.5
  Bottom 2: U$3.P$2 159.38,87.66 158.75,88.3 C2.-
VTH
  Bottom 0.813: U$1.13 142.88,114.31 142.88,116.84 | 142.88,116.84 R7.2 | IC1.7 30.48,87 31.12,87.63 31.12,132.72 31.75,133.35 73.66,133.35 74.3,132.72 74.3,119.38 74.93,118.75 130.18,118.75 130.81,118.11 130.81,116.84 142.88,116.84
W
  Bottom 1.27: C1.- U$1.2
  Bottom 2: U$3.P$1 165.73,97.16 165.1,97.8 C1.-

### Text on the board
Bottom: Inverter AC 3 phase Analog input / Galih Setyawan / scriptgalih@gmail.com | HIGH VOLTAGE / 312 VDC / 220 VAC | + | -